# EAGLE design EH 400 Mini-Synth (EAGLE 9.6.2)
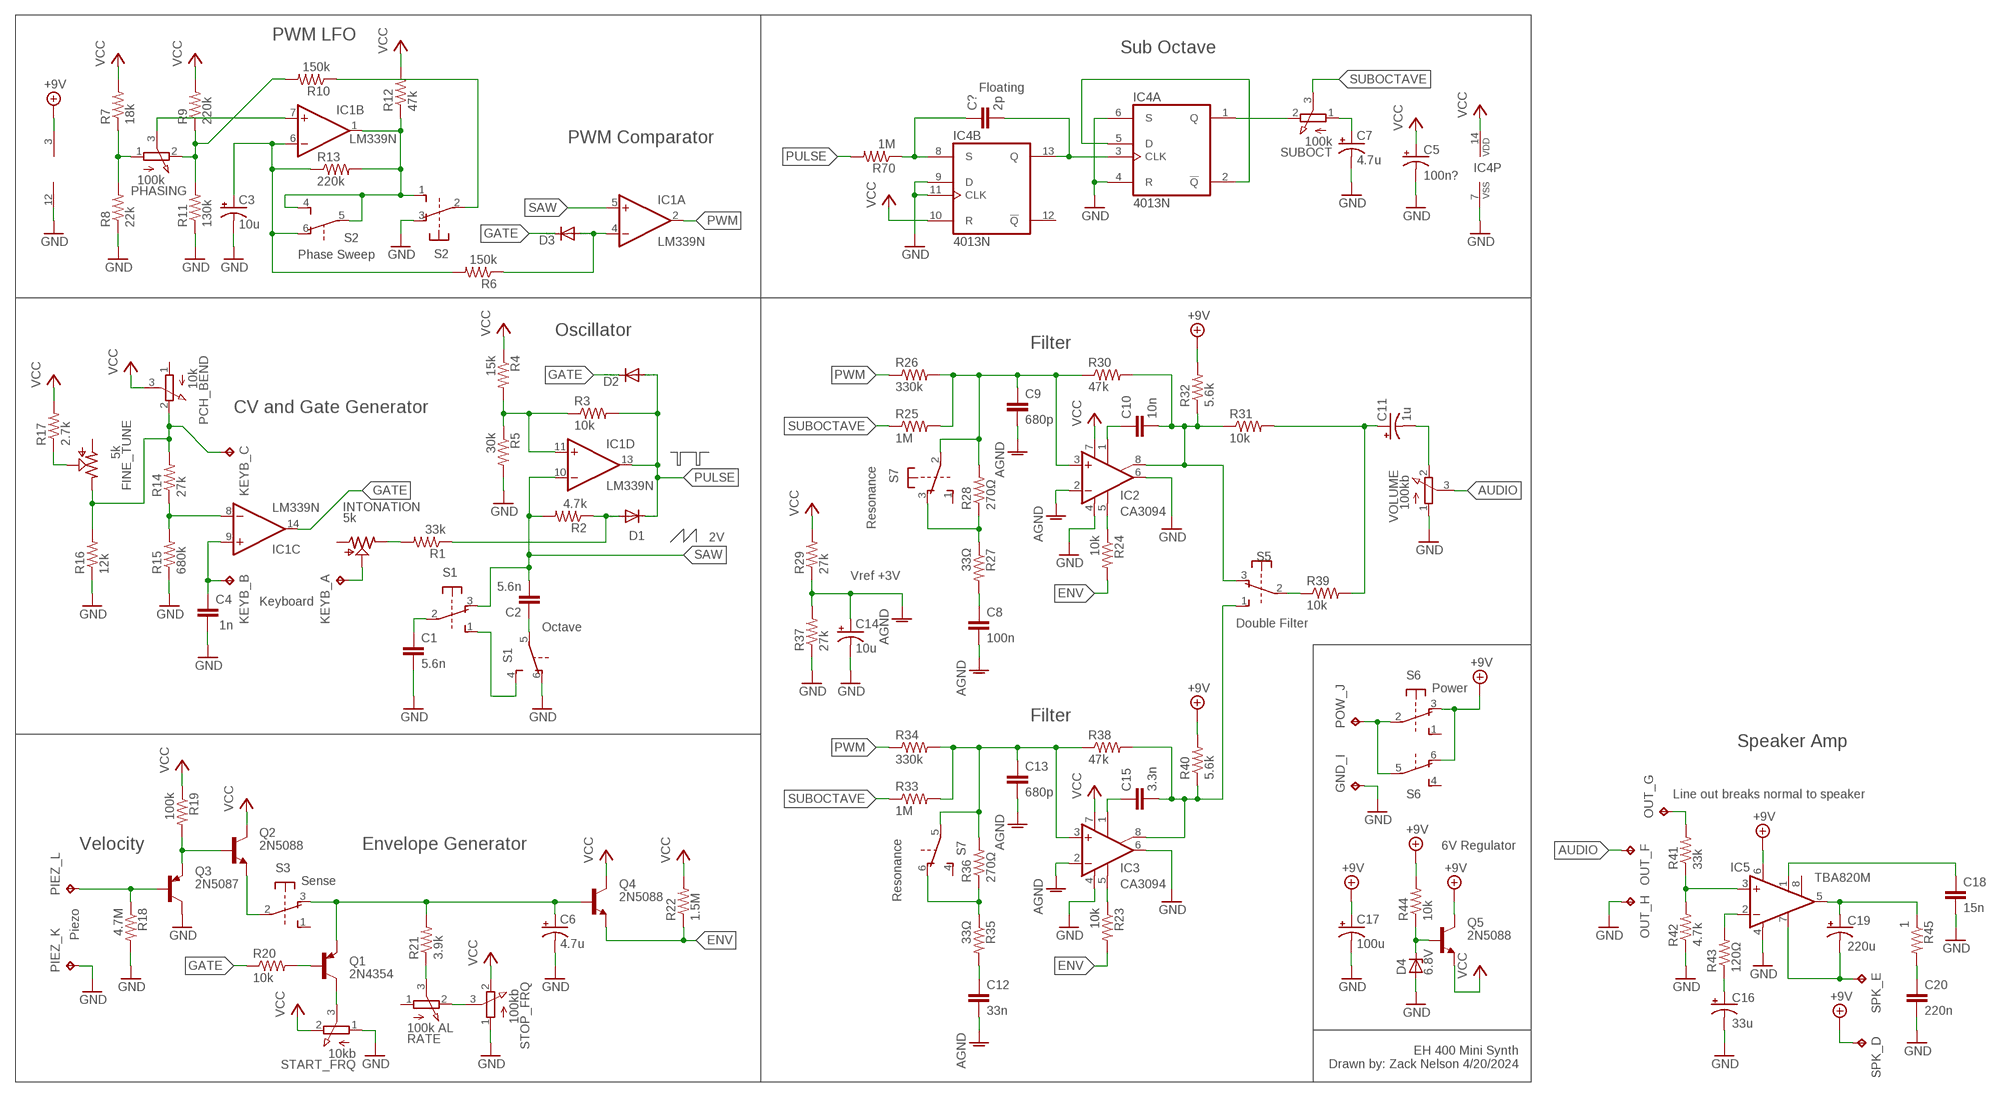
[diagram p0: schematic, sheet 1]

## Parts
C1  5.6n  C-EU050-024X044  [C050-024X044]
C2  5.6n  C-EU050-024X044  [C050-024X044]
C3  10u  CPOL-USE3.5-8  [E3,5-8]
C4  1n  C-EU050-024X044  [C050-024X044]
C5  100n?  CPOL-USE3.5-8  [E3,5-8]
C6  4.7u  CPOL-USE3.5-8  [E3,5-8]
C7  4.7u  CPOL-USE5-4  [E5-4]
C8  100n  C-EU050-024X044  [C050-024X044]
C9  680p  C-EU050-024X044  [C050-024X044]
C10  10n  C-EU050-025X075  [C050-025X075]
C11  1u  CPOL-USE5-4  [E5-4]
C12  33n  C-EU050-024X044  [C050-024X044]
C13  680p  C-EU050-024X044  [C050-024X044]
C14  10u  CPOL-USE3.5-8  [E3,5-8]
C15  3.3n  C-EU050-024X044  [C050-024X044]
C16  33u  CPOL-USE3.5-8  [E3,5-8]
C17  100u  CPOL-USTT5D9  [TT5D9]
C18  15n  C-EU050-024X044  [C050-024X044]
C19  220u  CPOL-USTT5D9  [TT5D9]
C20  220n  C-EU050-024X044  [C050-024X044]
C?  2p  C-EU075-032X103  [C075-032X103]
D1  DIODE-DO07  [DO07]
D2  DIODE-DO07  [DO07]
D3  DIODE-DO07  [DO07]
D4  6.8V  ZENER-DIODEZD-7.5  [ZDIO-7.5]
FINE_TUNE  5k  TRIM_US-ECP10S  [ECP10S]
GND_I  TPB1,27  [B1,27]
IC1  LM339N  [DIL14]
IC2  CA3094  LM3080N  [DIL08]
IC3  CA3094  LM3080N  [DIL08]
IC4  4013N  [DIL14]
IC5  TBA820M  LM386N-1  [DIL08]
INTONATION  5k  TRIM_US-ECP10S  [ECP10S]
KEYB_A  TPB1,27  [B1,27]
KEYB_B  TPB1,27  [B1,27]
KEYB_C  TPB1,27  [B1,27]
OUT_F  TPB1,27  [B1,27]
OUT_G  TPB1,27  [B1,27]
OUT_H  TPB1,27  [B1,27]
PCH_BEND  10k  EVUF  [FADER-EHX]
PHASING  100k  EVUF  [FADER-EHX]
PIEZ_K  TPB1,27  [B1,27]
PIEZ_L  TPB1,27  [B1,27]
POW_J  TPB1,27  [B1,27]
Q1  2N4354  2N5087-PNP-TO92-EBC  [TO92-EBC]
Q2  2N5088  2N5088-NPN-TO92-EBC  [TO92-EBC]
Q3  2N5087  2N5087-PNP-TO92-EBC  [TO92-EBC]
Q4  2N5088  2N5088-NPN-TO92-EBC  [TO92-EBC]
Q5  2N5088  2N5088-NPN-TO92-EBC  [TO92-EBC]
R1  33k  R-US_0207/12  [0207/12]
R2  4.7k  R-US_0207/12  [0207/12]
R3  10k  R-US_0207/12  [0207/12]
R4  15k  R-US_0207/12  [0207/12]
R5  30k  R-US_0207/12  [0207/12]
R6  150k  R-US_0207/12  [0207/12]
R7  18k  R-US_0207/12  [0207/12]
R8  22k  R-US_0207/12  [0207/12]
R9  220k  R-US_0207/12  [0207/12]
R10  150k  R-US_0207/12  [0207/12]
R11  130k  R-US_0207/12  [0207/12]
R12  47k  R-US_0207/12  [0207/12]
R13  220k  R-US_0207/12  [0207/12]
R14  27k  R-US_0207/12  [0207/12]
R15  680k  R-US_0207/12  [0207/12]
R16  12k  R-US_0207/12  [0207/12]
R17  2.7k  R-US_0207/12  [0207/12]
R18  4.7M  R-US_0207/12  [0207/12]
R19  100k  R-US_0207/12  [0207/12]
R20  10k  R-US_0207/12  [0207/12]
R21  3.9k  R-US_0207/12  [0207/12]
R22  1.5M  R-US_0207/12  [0207/12]
R23  10k  R-US_0207/12  [0207/12]
R24  10k  R-US_0207/12  [0207/12]
R25  1M  R-US_0207/12  [0207/12]
R26  330k  R-US_0207/12  [0207/12]
R27  33Ω  R-US_0207/12  [0207/12]
R28  270Ω  R-US_0207/12  [0207/12]
R29  27k  R-US_0207/12  [0207/12]
R30  47k  R-US_0207/12  [0207/12]
R31  10k  R-US_0207/12  [0207/12]
R32  5.6k  R-US_0207/12  [0207/12]
R33  1M  R-US_0207/12  [0207/12]
R34  330k  R-US_0207/12  [0207/12]
R35  33Ω  R-US_0207/12  [0207/12]
R36  270Ω  R-US_0207/12  [0207/12]
R37  27k  R-US_0207/12  [0207/12]
R38  47k  R-US_0207/12  [0207/12]
R39  10k  R-US_0207/12  [0207/12]
R40  5.6k  R-US_0207/12  [0207/12]
R41  33k  R-US_0207/12  [0207/12]
R42  4.7k  R-US_0207/12  [0207/12]
R43  120Ω  R-US_0207/12  [0207/12]
R44  10k  R-US_0207/12  [0207/12]
R45  1  R-US_0207/12  [0207/12]
R70  1M  R-US_0207/12  [0207/12]
RATE  100k AL  EVUF  [FADER-EHX]
S1  Octave  9077-2S  [SLIDE]
S2  Phase  9077-2S  [SLIDE]
S3  Sense  9077-2S  [SLIDE]
S5  Double Filter  9077-2S  [SLIDE]
S6  Power  9077-2S  [SLIDE]
S7  9077-2S  [SLIDE]
SPK_D  TPB1,27  [B1,27]
SPK_E  TPB1,27  [B1,27]
START_FRQ  10kb  EVUF  [FADER-EHX]
STOP_FRQ  100kb  EVUF  [FADER-EHX]
SUBOCT  100k  EVUF  [FADER-EHX]
VOLUME  100kb  EVUF  [FADER-EHX]

## Nets
+9V: C17.+ IC1.3(P:V+) IC5.6(VS) Q5.C R32.2 R40.2 R44.2 S6.3(1:O) S6.6(2:O) SPK_D.TP
AGND: C8.2 C9.2 C12.2 C13.2 C14.+ IC2.2(-IN) IC3.2(-IN) R29.1 R37.2
AUDIO: OUT_F.TP VOLUME.3(S)
C: FINE_TUNE.E KEYB_C.TP PCH_BEND.2(E) R14.2 R16.2
ENV: Q4.E R22.1 R23.2 R24.2
GATE: D2.C D3.C IC1.14(C:OUT) R20.1
GND: C1.2 C3.- C4.2 C5.- C6.- C7.- C14.- C16.- C17.- C18.2 C20.2 D4.A GND_I.TP IC1.12(P:GND) IC2.4(V-) IC2.6(OUT) IC3.4(V-) IC3.6(OUT) IC4.4(A:R) IC4.6(A:S) IC4.7(P:VSS) IC4.9(B:D) IC4.11(B:CLK) IC5.4(GND) OUT_H.TP PIEZ_K.TP Q3.C R5.2 R8.1 R11.1 R15.1 R16.1 R18.2 R37.1 R42.1 S1.6(2:O) S2.3(1:O) START_FRQ.1(A) STOP_FRQ.1(A) VOLUME.1(A)
LFO_TRI: C3.+ IC1.6(B:-IN) R6.2 R13.1 S2.6(2:O)
N$1: C?.1 IC4.8(B:S) R70.1
N$2: D1.A R1.1 R2.1
N$3: INTONATION.E R1.2
N$4: IC1.11(D:+IN) R3.1 R4.2 R5.1
N$5: C?.2 IC4.3(A:CLK) IC4.13(B:Q)
N$6: IC1.1(B:OUT) R12.1 R13.2 S2.1(1:S) S2.4(2:S) S2.5(2:P)
N$7: D3.A IC1.4(A:-IN) R6.1
N$8: IC4.2(A:!Q) IC4.5(A:D)
N$9: PIEZ_L.TP Q3.B R18.1
N$10: S1.1(1:S) S1.4(2:S)
N$11: C1.1 S1.2(1:P)
N$12: C2.1 S1.5(2:P)
N$13: PHASING.1(A) R7.1 R8.2
N$14: PHASING.2(E) R9.1 R10.2 R11.2
N$15: IC1.7(B:+IN) PHASING.3(S)
N$16: R10.1 S2.2(1:P)
N$17: Q2.B Q3.E R19.2
N$18: C4.1 IC1.9(C:+IN) KEYB_B.TP
N$19: INTONATION.S KEYB_A.TP
N$20: IC1.8(C:-IN) R14.1 R15.2
N$21: Q2.E S3.2(1:P)
N$22: FINE_TUNE.S R17.1
N$23: RATE.2(E) STOP_FRQ.3(S)
N$24: C19.+ IC5.5(OUT) R45.1
N$25: C6.+ Q1.E Q4.B R21.2 S3.3(1:O)
N$26: Q1.B R20.2
N$27: R21.1 RATE.3(S)
N$28: Q1.C START_FRQ.3(S)
N$29: C18.1 IC5.1(GAIN)
N$30: C7.+ SUBOCT.1(A)
N$31: R39.1 S5.2(1:P)
N$32: IC2.5(OPT) R24.1
N$33: C9.1 IC2.3(+IN) R25.2 R26.2 R28.2 R30.1 S7.2(1:P)
N$34: IC4.1(A:Q) SUBOCT.2(E)
N$35: C8.1 R27.2
N$36: C10.2 IC2.8(ON2) R30.2 R31.1 R32.1 S5.3(1:O)
N$37: R27.1 R28.1 S7.3(1:O)
N$38: IC3.5(OPT) R23.1
N$39: C10.1 IC2.1(ON1)
N$40: C12.1 R35.2
N$41: R35.1 R36.1 S7.6(2:O)
N$42: C15.1 IC3.1(ON1)
N$43: C15.2 IC3.8(ON2) R38.2 R40.1 S5.1(1:S)
N$44: C13.1 IC3.3(+IN) R33.2 R34.2 R36.2 R38.1 S7.5(2:P)
N$45: C11.+ R31.2 R39.2
N$46: C11.- VOLUME.2(E)
N$47: C20.1 R45.2
N$48: C19.- IC5.7(BYPASS) SPK_E.TP
N$49: D4.C Q5.B R44.1
N$50: IC5.2(-IN) R43.2
N$51: C16.+ R43.1
N$52: OUT_G.TP R41.2
N$53: IC5.3(+IN) R41.1 R42.2
N$54: POW_J.TP S6.2(1:P) S6.5(2:P)
PULSE: D1.C D2.A IC1.13(D:OUT) R3.2 R70.2
PWM: IC1.2(A:OUT) R26.1 R34.1
SAW: C2.2 IC1.5(A:+IN) IC1.10(D:-IN) R2.2 S1.3(1:O)
SUBOCTAVE: R25.1 R33.1 SUBOCT.3(S)
VCC: C5.+ IC2.7(V+) IC3.7(V+) IC4.10(B:R) IC4.14(P:VDD) PCH_BEND.3(S) Q2.C Q4.C Q5.E R4.1 R7.2 R9.2 R12.2 R17.2 R19.1 R22.2 R29.2 START_FRQ.2(E) STOP_FRQ.2(E)
Unconnected: FINE_TUNE.A IC4.12(B:!Q) IC5.8(GAIN) INTONATION.A PCH_BEND.1(A) RATE.1(A) S3.1(1:S) S3.4(2:S) S3.5(2:P) S3.6(2:O) S5.4(2:S) S5.5(2:P) S5.6(2:O) S6.1(1:S) S6.4(2:S) S7.1(1:S) S7.4(2:S)

## Notes on the sheet
- PWM LFO
- Sub Octave
- Floating
- PWM Comparator
- Phase Sweep
- Oscillator
- Filter
- CV and Gate Generator
- Resonance
- 2V
- Vref +3V
- Keyboard
- Octave
- Filter
- Speaker Amp
- Line out breaks normal to speaker
- Velocity | Envelope Generator | 6V Regulator
- Resonance
- Piezo
- EH 400 Mini Synth
  Drawn by: Zack Nelson 4/20/2024

## Library data of the parts
C1 C2 C4 C8-C10 C12 C13 C15 C18 C20 C? = rcl:C-EU: CAPACITOR, European symbol; SPICEPREFIX: C
C3 C5-C7 C11 C14 C16 C17 C19 = rcl:CPOL-US: POLARIZED CAPACITOR, American symbol; SPICEPREFIX: C
D1-D3 = diode:DIODE-: DIODE
D4 = diode:ZENER-DIODE: Z-Diode
FINE_TUNE INTONATION = pot2:TRIM_US-: POTENTIOMETER
GND_I KEYB_A KEYB_B KEYB_C OUT_F OUT_G OUT_H PIEZ_K PIEZ_L POW_J SPK_D SPK_E = testpad:TP: Test pad
IC1 = linear:LM339: Low Power Low Offset Voltage Quad Comparators with open collector; LM139/LM239/LM339/LM2901/LM3302
IC2 IC3 = linear@1:*3080: OP AMP
IC4 = 40xx:4013: Dual D FLIP FLOP, set/reset
IC5 = linear:LM386?-*: Low Voltage Audio Power Amplifier Source: http://cache.national.com/ds/LM/LM386.pdf
PCH_BEND PHASING RATE START_FRQ STOP_FRQ SUBOCT VOLUME = pot:EVU: 9 mm Square Rotary Potentiometers Source: Panasonic
Q1 Q3 = transistor-neu-to92:*-PNP-: PNP Transistror
Q2 Q4 Q5 = transistor-neu-to92:*-NPN-: NPN Transistror
R1-R45 R70 = rcl:R-US_: RESISTOR, American symbol; SPICEPREFIX: R
S1-S3 S5-S7 = switch-misc:9077-2: MARQUARDT SWITCH 9077.0200 Distributor: Buerklin <https://www.buerklin.com/default.asp?event=ShowArtikel%2812G2822%29&l=d&jump=ArtNr_12G2822>

## Board
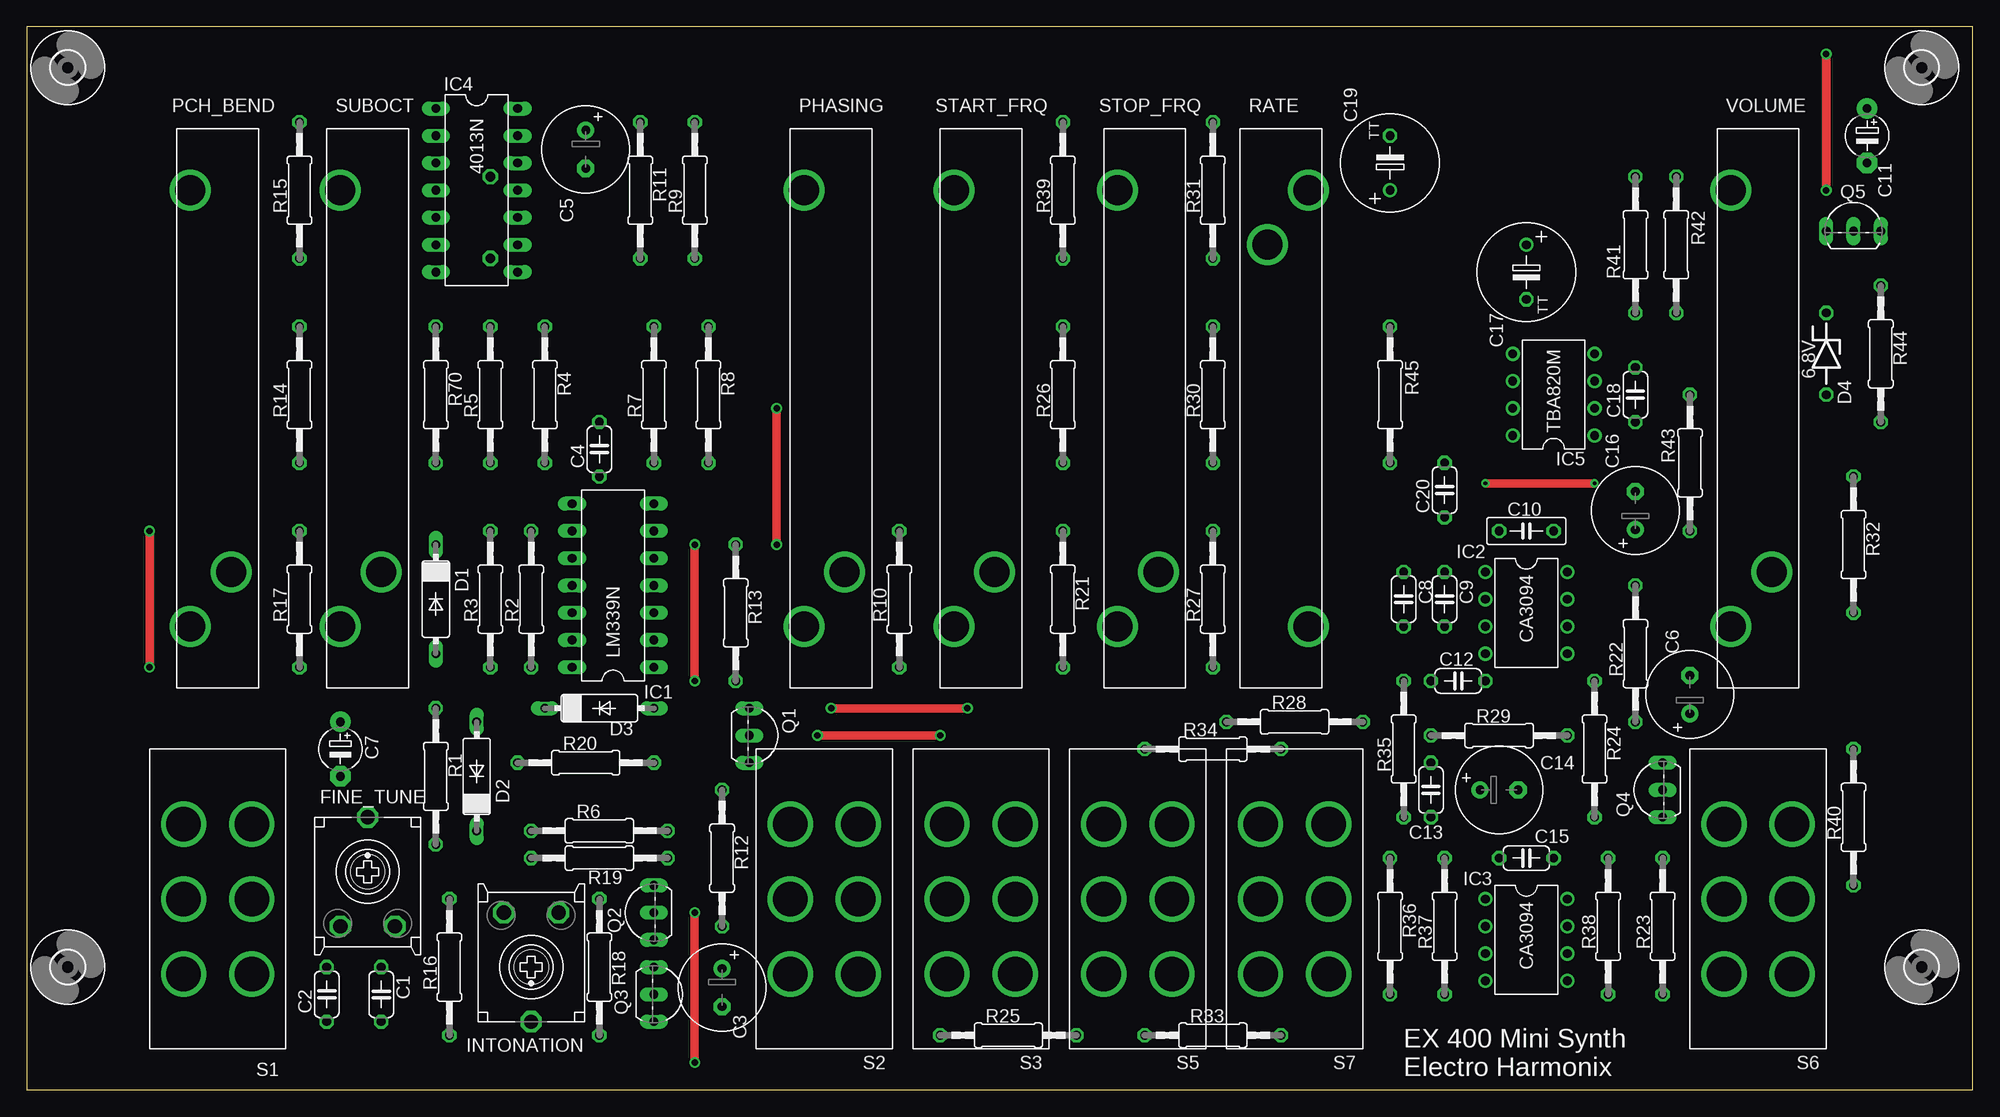
[diagram p1: board, top side]
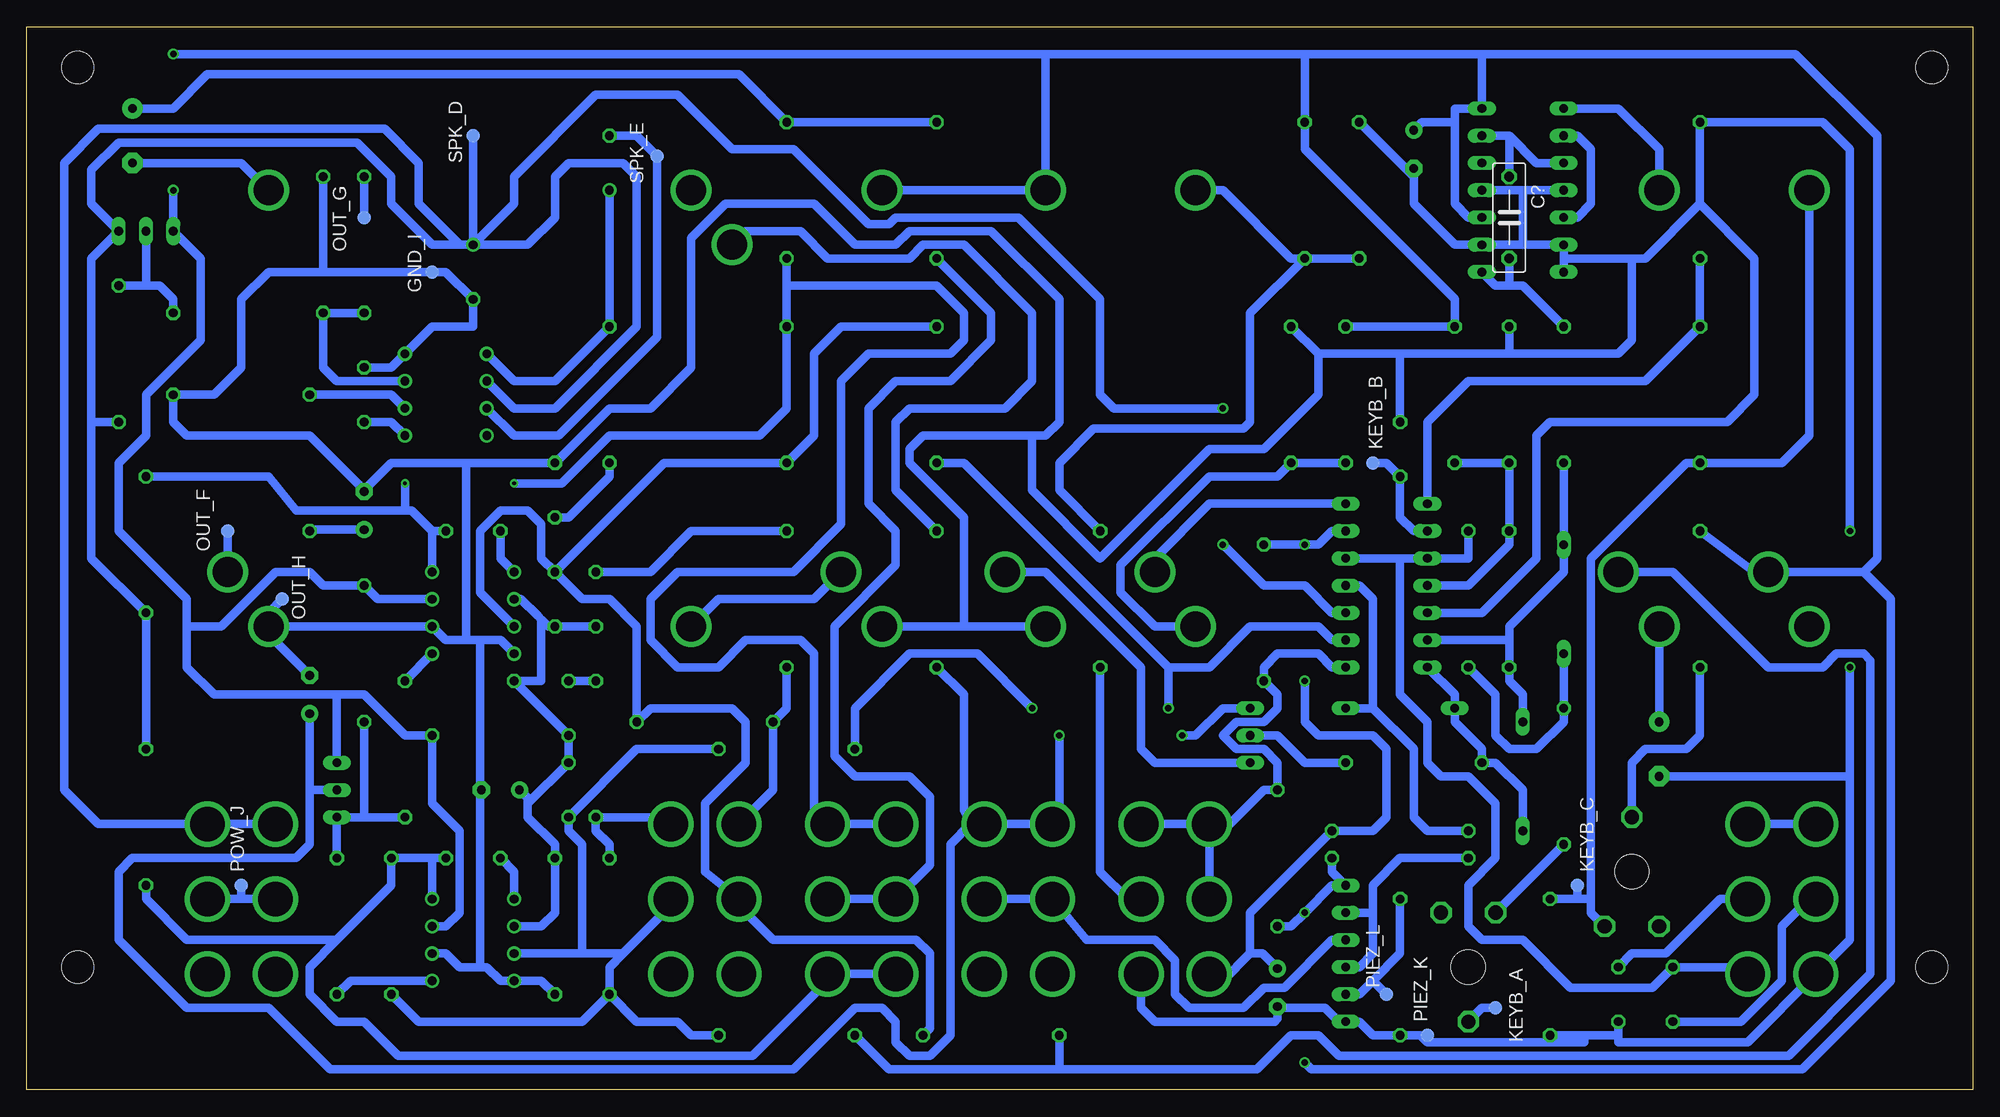
[diagram p2: board, bottom side, seen from below]

Size 181.28 x 99.05 mm. Coordinates in mm from the lower left corner, seen from the top.
Outline: 0,0 181.28,0 181.28,99.05 0,99.05 0,0
Copper layers (1*16): Top 0.035mm / dielectric 1.5mm / Bottom 0.035mm
Design rules "default": minimum track width 6mil, minimum drill 0.35mm, track to track 6mil, track to pad 6mil, pad to pad 6mil, via to via 6mil, smd to smd 6mil, copper to edge 40mil, drill to drill 6mil, minimum pad ring 10mil, minimum via ring 8mil, stop-mask expansion 4mil, vias tented up to drill 0mil, thermal gap 10mil
Holes 3.2 mm at 31.75,20.32 46.99,11.43

### Footprints (pad centres in the part's own frame; a part is rotated, then mirrored left to right if it is on the bottom)
C050-024X044 = drill 0.813 octagon: 1 -2.54,0; 2 2.54,0
E3,5-8 = drill 0.813 pad 1.6: + -1.778,0 | drill 0.813 pad 1.6 octagon: - 1.778,0
E5-4 = drill 0.813 pad 1.905: + -2.54,0 | drill 0.813 pad 1.905 octagon: - 2.54,0
C050-025X075 = drill 0.813 octagon: 1 -2.54,0; 2 2.54,0
TT5D9 = drill 0.813: + -2.54,0 | drill 0.813 octagon: - 2.54,0
C075-032X103 = drill 0.914 octagon: 1 -3.81,0; 2 3.81,0
DO07 = drill 0.813 long: A 5.08,0; C -5.08,0
ZDIO-7.5 = drill 0.813 octagon: A 3.81,0; C -3.81,0
ECP10S = drill 1.321 octagon: A -2.54,-5.08; E 2.54,-5.08; S 0,5.08
B1,27 = smd 1.27 x 1.27: TP 0,0
DIL14 = drill 0.813 long: 1 -7.62,-3.81; 2 -5.08,-3.81; 3 -2.54,-3.81; 4 0,-3.81; 5 2.54,-3.81; 6 5.08,-3.81; 7 7.62,-3.81; 8 7.62,3.81; 9 5.08,3.81; 10 2.54,3.81; 11 0,3.81; 12 -2.54,3.81; 13 -5.08,3.81; 14 -7.62,3.81
DIL08 = drill 0.813 pad 1.27: 1 -3.81,-3.81; 2 -1.27,-3.81; 3 1.27,-3.81; 4 3.81,-3.81; 5 3.81,3.81; 6 1.27,3.81; 7 -1.27,3.81; 8 -3.81,3.81
FADER-EHX = drill 2.8: 1 -2.54,-20.32; 2 -2.54,20.32; 3 1.27,-15.24
TO92-EBC = drill 0.813 long: B 0,-1.27; C 2.54,-1.27; E -2.54,-1.27
0207/12 = drill 0.813 octagon: 1 -6.35,0; 2 6.35,0
SLIDE = drill 3.2: 1 -6.985,3.175; 2 0,3.175; 3 6.985,3.175; 4 -6.985,-3.175; 5 0,-3.175; 6 6.985,-3.175
3,0 = hole 3: 0,0

### Placement (x,y rotation side)
C1  33.02,8.89 270 top
C2  27.94,8.89 90 top
C3  64.77,9.53 270 top
C4  53.34,59.69 90 top
C5  52.07,87.63 270 top
C6  154.94,36.83 90 top
C7  29.21,31.75 270 top
C8  128.27,45.72 270 top
C9  132.08,45.72 270 top
C10  139.7,52.07 0 top
C11  171.45,88.9 270 top
C12  133.35,38.1 0 top
C13  130.81,27.94 90 top
C14  137.16,27.94 0 top
C15  139.7,21.59 0 top
C16  149.86,53.98 90 top
C17  139.7,76.2 270 top
C18  149.86,64.77 90 top
C19  127,86.36 90 top
C20  132.08,55.88 90 top
C?  43.18,81.28 90 bottom
D1  38.1,45.72 270 top
D2  41.91,29.21 90 top
D3  53.34,35.56 0 top
D4  167.64,68.58 270 top
FINE_TUNE  31.75,20.32 0 top
GND_I  143.51,76.2 90 bottom
IC1  54.61,46.99 90 top
IC2  139.7,44.45 270 top
IC3  139.7,13.97 270 top
IC4  41.91,83.82 270 top
IC5  142.24,64.77 90 top
INTONATION  46.99,11.43 180 top
KEYB_A  44.45,7.62 0 bottom
KEYB_B  55.88,58.42 0 bottom
KEYB_C  36.83,19.05 0 bottom
OUT_F  162.56,52.07 90 bottom
OUT_G  149.86,81.28 270 bottom
OUT_H  157.48,45.72 90 bottom
PCH_BEND  17.78,63.5 0 top
PHASING  74.93,63.5 0 top
PIEZ_K  50.8,5.08 0 bottom
PIEZ_L  54.61,8.89 0 bottom
POW_J  161.29,19.05 0 bottom
Q1  68.58,33.02 270 top
Q2  57.15,16.51 90 top
Q3  59.69,8.89 270 top
Q4  151.13,27.94 90 top
Q5  170.18,81.28 0 top
R1  38.1,29.21 270 top
R2  46.99,45.72 90 top
R3  43.18,45.72 270 top
R4  48.26,64.77 270 top
R5  43.18,64.77 90 top
R6  53.34,24.13 0 top
R7  58.42,64.77 90 top
R8  63.5,64.77 270 top
R9  62.23,83.82 90 top
R10  81.28,45.72 90 top
R11  57.15,83.82 270 top
R12  64.77,21.59 270 top
R13  66.04,44.45 270 top
R14  25.4,64.77 270 top
R15  25.4,83.82 270 top
R16  39.37,11.43 90 top
R17  25.4,45.72 90 top
R18  53.34,11.43 270 top
R19  53.34,21.59 180 top
R20  52.07,30.48 0 top
R21  96.52,45.72 270 top
R22  149.86,40.64 90 top
R23  152.4,15.24 90 top
R24  146.05,31.75 270 top
R25  91.44,5.08 0 top
R26  96.52,64.77 90 top
R27  110.49,45.72 90 top
R28  118.11,34.29 0 top
R29  137.16,33.02 0 top
R30  110.49,64.77 90 top
R31  110.49,83.82 90 top
R32  170.18,50.8 270 top
R33  110.49,5.08 0 top
R34  110.49,31.75 0 top
R35  128.27,31.75 90 top
R36  127,15.24 270 top
R37  132.08,15.24 90 top
R38  147.32,15.24 90 top
R39  96.52,83.82 90 top
R40  170.18,25.4 90 top
R41  149.86,78.74 90 top
R42  153.67,78.74 270 top
R43  154.94,58.42 90 top
R44  172.72,68.58 270 top
R45  127,64.77 270 top
R70  38.1,64.77 270 top
RATE  116.84,63.5 180 top
S1  17.78,17.78 270 top
S2  74.3,17.78 270 top
S3  88.9,17.78 90 top
S5  103.5,17.78 90 top
S6  161.29,17.78 90 top
S7  118.11,17.78 90 top
SPK_D  139.7,88.9 90 bottom
SPK_E  122.56,87 270 bottom
START_FRQ  88.9,63.5 0 top
STOP_FRQ  104.14,63.5 0 top
SUBOCT  31.75,63.5 0 top
U$1  [3,0]  3.81,95.25 0 top
U$2  [3,0]  176.53,95.25 0 top
U$3  [3,0]  3.81,11.43 0 top
U$4  [3,0]  176.53,11.43 0 top
VOLUME  161.29,63.5 0 top

### Tracks (layer width: path | path; a pad name or v marks a point on that pad's centre or on a via)
+9V  (via drill 0.6)
  Top 0.813: v69.85,50.8 v69.85,63.5
  Bottom 0.813: IC1.3 59.69,44.45 62.23,46.99 66.04,46.99 v69.85,50.8 | v69.85,63.5 80.01,63.5 81.28,64.77 81.28,73.66 88.9,81.28 100.33,81.28 100.97,80.64 102.87,80.64 109.86,87.63 115.57,87.63 120.65,92.71 128.27,92.71 135.89,85.09 135.89,82.55 C17.+ | 175.26,62.23 175.26,77.47 Q5.C 175.26,82.55 175.26,85.72 172.72,88.27 150.5,88.27 147.32,85.09 147.32,82.55 143.51,78.74 140.97,78.74 | 175.26,62.23 175.26,49.53 R32.2 R40.2 | S6.3 S6.6 174.62,24.77 177.8,27.94 177.8,86.36 174.62,89.53 147.96,89.53 144.78,86.36 144.78,82.55 140.97,78.74 | C17.+ 134.62,78.74 132.08,81.28 132.08,85.09 130.81,86.36 125.73,86.36 124.46,85.09 124.46,71.12 132.08,63.5 135.89,63.5 IC5.6 | 140.97,78.74 C17.+ | C17.+ SPK_D.TP | R44.2 175.26,62.23
AGND
  Bottom 0.813: IC3.2 133.35,15.24 132.08,16.51 R37.2 132.08,22.86 134.62,25.4 134.62,26.67 | 134.62,26.67 C13.2 R29.1 C12.2 133.35,38.1 133.35,43.81 | 134.62,26.67 134.62,27.18 C14.+ | C8.2 C9.2 132.72,43.18 133.35,43.81 | IC2.2 135.25,45.72 133.67,44.13 133.35,43.81
AUDIO
  Bottom 0.813: OUT_F.TP VOLUME.3
C
  Bottom 0.813: 35.56,17.78 35.56,16.51 FINE_TUNE.E | R16.2 36.83,17.78 | 36.83,17.78 35.56,17.78 | 35.56,17.78 35.56,49.53 26.67,58.42 R14.2 17.78,58.42 15.24,60.96 PCH_BEND.2 | KEYB_C.TP 36.83,17.78
ENV
  Bottom 0.813: 149.86,25.4 Q4.E R23.2 | 149.86,25.4 R24.2 | R22.1 149.86,25.4
GATE
  Bottom 0.813: IC1.14 48.26,36.83 D3.C 48.26,34.29 45.72,31.75 R20.1 44.45,30.48 41.91,27.94 D2.C
GND  (via drill 0.6)
  Top 0.813: v11.43,52.07 v11.43,39.37
  Bottom 0.813: IC4.4 41.91,83.82 | 41.91,83.82 IC4.11 | 41.91,83.82 41.91,78.74 | 41.91,78.74 IC4.6 38.1,77.47 | IC4.7 38.1,77.47 | R5.2 43.18,68.58 | 43.18,68.58 53.34,68.58 | 53.34,68.58 60.96,68.58 | 43.18,68.58 33.02,68.58 31.75,69.85 31.75,77.47 | 31.75,77.47 38.1,77.47 | R37.1 133.35,10.16 IC3.4 137.16,10.16 138.43,11.43 139.06,11.43 | 140.34,41.91 142.24,41.91 IC2.6 VOLUME.1 | 41.91,78.74 IC4.9 48.26,78.74 52.07,82.55 52.07,85.09 52.7,85.72 | C4.2 53.34,68.58 | 33.02,5.08 33.02,4.45 20.95,4.45 S1.6 11.43,13.97 11.43,29.21 | 33.02,5.08 C1.2 | R18.2 51.44,5.08 50.8,4.45 36.2,4.45 36.2,5.08 R16.1 33.02,5.08 | R11.1 52.7,85.72 | IC3.6 142.24,12.7 140.97,11.43 139.06,11.43 | IC2.4 137.16,41.91 139.06,41.91 | 139.06,41.91 140.34,41.91 | R18.2 55.88,5.08 57.15,6.35 Q3.C 59.05,6.35 60.33,7.62 64.77,7.62 C3.- 64.77,6.6 65.02,6.35 76.2,6.35 77.47,7.62 S2.3 | IC1.12 45.72,44.45 40.64,49.53 40.64,60.96 39.37,62.23 22.86,62.23 20.32,64.77 20.32,77.47 25.4,82.55 | 25.4,82.55 30.48,77.47 31.75,77.47 | v11.43,52.07 11.43,87.63 13.97,90.17 R15.1 25.4,82.55 | v11.43,39.37 11.43,29.21 | 11.43,29.21 C7.- | 139.06,41.91 139.06,27.94 | 139.06,27.94 139.06,11.43 | C14.- 139.06,27.94 | START_FRQ.1 93.98,43.18 | STOP_FRQ.1 93.98,43.18 | 93.98,43.18 93.98,53.34 99.06,58.42 99.06,59.69 97.79,60.96 87.63,60.96 | 87.63,60.96 86.36,60.96 85.09,62.23 85.09,73.66 91.44,80.01 99.06,80.01 100.33,78.74 104.14,78.74 107.95,82.55 116.2,82.55 119.38,79.38 119.38,67.31 123.19,63.5 127,63.5 C20.2 140.34,58.42 | R8.1 60.96,68.58 | 60.96,68.58 60.96,64.77 66.04,59.69 71.12,59.69 81.28,49.53 87.63,55.88 87.63,60.96 | C18.2 147.32,67.31 IC5.4 143.51,71.12 139.7,71.12 C17.- 142.24,76.2 GND_I.TP 153.67,76.2
  Bottom 0.813: R42.1 153.67,76.2 | 153.67,76.2 158.75,76.2 161.29,73.66 161.29,67.31 163.83,64.77 D4.A 167.64,62.23 166.37,60.96 154.94,60.96 149.86,55.88 | C6.- 158.75,42.42 VOLUME.1 | OUT_H.TP 158.75,44.45 VOLUME.1 | C5.- 52.58,85.85 52.7,85.72 | C16.- 149.86,55.88 | 149.86,55.88 147.32,58.42 140.34,58.42 | 140.34,58.42 140.34,41.91 | R18.2 PIEZ_K.TP
LFO_TRI  (via drill 0.6)
  Top 0.813: v62.23,38.1 v62.23,50.8
  Bottom 0.813: IC1.6 59.69,52.07 60.96,50.8 v62.23,50.8 R13.1 | v62.23,38.1 62.23,34.29 60.96,33.02 55.88,33.02 54.61,31.75 54.61,25.4 55.88,24.13 R6.2 67.31,16.51 67.31,12.7 | 67.31,12.7 69.85,10.16 71.12,10.16 S2.6 | C3.+ 66.17,12.7 67.31,12.7
N$1
  Bottom 0.813: R70.1 41.91,74.93 43.18,74.93 | IC4.8 44.45,74.93 43.18,74.93 | C?.1 43.18,74.93
N$2
  Bottom 0.813: D1.A R1.1 38.1,34.29 40.64,31.75 43.18,31.75 44.45,33.02 44.45,36.83 R2.1
N$3
  Bottom 0.813: R1.2 INTONATION.E
N$4
  Bottom 0.813: IC1.11 46.99,46.99 43.18,50.8 R3.1 R5.1 R4.2
N$5
  Bottom 0.813: 43.18,88.9 40.64,86.36 IC4.3 | 43.18,88.9 IC4.13 | C?.2 43.18,88.9
N$6
  Bottom 0.813: IC1.1 59.69,39.37 60.96,40.64 64.77,40.64 66.04,39.37 R13.2 64.77,36.83 64.77,35.56 66.04,34.29 68.58,34.29 69.85,33.02 68.58,31.75 66.04,31.75 64.77,30.48 R12.1 66.04,27.94 69.85,24.13 71.12,24.13 | S2.1 S2.4 71.12,24.13 | 71.12,24.13 S2.5
N$7
  Bottom 0.813: IC1.4 57.15,46.99 55.88,45.72 55.88,35.56 | R6.1 50.8,24.13 52.07,25.4 52.07,31.75 55.88,35.56 | 55.88,35.56 D3.A
N$8
  Bottom 0.813: IC4.2 36.83,88.9 35.56,87.63 35.56,82.55 36.83,81.28 IC4.5
N$9
  Bottom 0.813: R18.1 53.34,12.7 55.88,10.16 | 55.88,10.16 57.15,8.89 Q3.B | PIEZ_L.TP 55.88,10.16
N$10
  Bottom 0.813: S1.4 S1.1
N$11
  Bottom 0.813: C1.1 31.75,12.7 28.57,12.7 23.5,17.78 S1.2
N$12
  Bottom 0.813: C2.1 21.59,6.35 17.78,10.16 17.78,15.24 15.24,17.78 S1.5
N$13
  Bottom 0.813: R7.1 R8.2 64.77,57.15 71.12,57.15 79.38,48.9 79.38,46.35 76.2,43.18 PHASING.1
N$14
  Bottom 0.813: R11.2 R9.1 | R9.1 63.5,77.47 69.85,83.82 PHASING.2 | R10.2 85.09,55.88 85.09,58.42 81.92,61.59 67.94,61.59 67.31,62.23 67.31,72.39 R9.1
N$15
  Bottom 0.813: IC1.7 71.12,54.61 76.2,49.53 PHASING.3
N$16
  Bottom 0.813: R10.1 81.28,20.32 78.74,17.78 S2.2
N$17
  Bottom 0.813: 55.88,16.51 55.88,12.7 57.15,11.43 Q3.E | 55.88,16.51 Q2.B | R19.2 53.34,21.59 55.88,19.05 55.88,16.51
N$18
  Bottom 0.813: IC1.9 52.07,52.07 53.34,53.34 C4.1 54.61,58.42 KEYB_B.TP
N$19
  Bottom 0.813: INTONATION.S 45.72,7.62 KEYB_A.TP
N$20
  Bottom 0.813: R15.2 R14.1 30.48,66.04 46.99,66.04 50.8,62.23 IC1.8
N$21
  Bottom 0.813: Q2.E 59.69,13.97 64.14,9.53 66.04,9.53 67.94,7.62 73.03,7.62 74.3,8.89 74.3,12.06 76.2,13.97 82.55,13.97 S3.2 92.71,17.78
N$22
  Bottom 0.813: FINE_TUNE.S 31.75,30.48 30.48,31.75 26.67,31.75 25.4,33.02 R17.1
N$23
  Bottom 0.813: STOP_FRQ.3 107.95,45.72 116.84,45.72 RATE.2
N$24
  Bottom 0.813: IC5.5 135.89,66.04 132.08,66.04 R45.1 C19.+
N$25  (via drill 0.6)
  Top 0.813: v73.66,33.02 v85.09,33.02
  Bottom 0.813: Q1.E 69.85,35.56 72.39,33.02 v73.66,33.02 | v85.09,33.02 85.09,25.4 S3.3 93.34,24.77 | C6.+ 154.94,27.94 | 93.34,24.77 95.25,22.86 95.25,5.08 97.16,3.17 99.06,3.17 100.33,4.45 100.33,6.35 101.6,7.62 104.14,7.62 109.86,1.91 153.03,1.91 158.75,7.62 166.37,7.62 172.72,13.97 172.72,20.32 171.45,21.59 156.21,21.59 154.94,22.86 154.94,27.94 | 93.34,24.77 93.98,26.04 93.98,36.83 R21.2 | Q4.B 154.94,27.94
N$26
  Bottom 0.813: R20.2 59.69,30.48 62.23,30.48 64.77,33.02 Q1.B
N$27
  Bottom 0.813: R21.1 100.33,55.88 100.33,62.23 99.06,63.5 90.17,63.5 87.63,66.04 87.63,72.39 93.98,78.74 97.79,78.74 99.06,77.47 106.68,77.47 109.22,80.01 114.3,80.01 RATE.3
N$28
  Bottom 0.813: Q1.C 76.2,30.48 77.47,31.75 77.47,39.37 86.36,48.26 START_FRQ.3
N$29
  Bottom 0.813: IC5.1 147.32,62.23 C18.1
N$30
  Bottom 0.813: C7.+ SUBOCT.1
N$31
  Bottom 0.813: R39.1 91.44,72.39 91.44,69.85 95.25,66.04 100.33,66.04 102.87,63.5 102.87,54.61 100.33,52.07 100.33,48.9 106.05,43.18 106.05,31.11 104.14,29.21 99.06,29.21 97.16,27.3 97.16,20.95 S5.2 106.68,17.78
N$32
  Bottom 0.813: R24.1 IC2.5
N$33
  Bottom 0.813: IC2.3 139.06,46.35 139.06,52.07 137.16,53.98 134.62,53.98 133.35,52.7 133.35,49.53 C9.1 | R26.2 105.41,71.12 107.95,68.58 107.95,60.96 R30.1 121.92,58.42 C9.1 | C9.1 129.54,45.72 127,45.72 124.46,43.18 R28.2 123.19,35.56 115.57,35.56 114.3,34.29 114.3,30.48 118.11,26.67 118.11,20.32 S7.2 114.94,17.14 111.76,13.97 98.42,13.97 97.16,12.7 97.16,5.71 R25.2
N$34
  Bottom 0.813: SUBOCT.2 29.21,87.63 33.02,91.44 IC4.1
N$35
  Bottom 0.813: R27.2 119.38,52.07 123.19,48.26 C8.1
N$36  (via drill 0.35)
  Top 0.813: v135.89,56.52 v146.05,56.52
  Bottom 0.813: R31.1 110.49,74.93 | 110.49,74.93 R30.2 110.49,63.5 113.03,60.96 127,60.96 131.44,56.52 v135.89,56.52 | v146.05,56.52 146.05,53.98 | 146.05,53.98 145.41,53.98 143.51,52.07 | 143.51,52.07 IC2.8 | C10.2 143.51,52.07 | S5.3 107.95,24.77 107.95,40.64 109.22,41.91 114.3,41.91 116.84,39.37 120.65,39.37 123.19,41.91 123.19,45.72 120.65,48.26 109.86,48.26 105.41,52.7 105.41,66.04 102.87,68.58 95.25,68.58 93.98,69.85 93.98,72.39 96.52,74.93 110.49,74.93 | R32.1 158.75,57.15 156.21,53.98 146.05,53.98
N$37
  Bottom 0.813: R27.1 110.49,35.56 R28.1 111.76,27.94 S7.3
N$38
  Bottom 0.813: IC3.5 151.13,10.16 R23.1
N$39
  Bottom 0.813: C10.1 137.16,49.53 IC2.1
N$40
  Bottom 0.813: C12.1 R35.2
N$41
  Bottom 0.813: R36.1 127,22.86 128.27,24.13 R35.1 121.92,25.4 S7.6
N$42
  Bottom 0.813: C15.1 135.89,20.32 IC3.1
N$43
  Bottom 0.813: IC3.8 143.51,21.59 | 143.51,21.59 C15.2 | 143.51,21.59 R38.2 147.32,19.05 152.4,13.97 | 152.4,13.97 154.94,11.43 154.94,8.89 152.4,6.35 149.86,6.35 146.69,3.17 113.67,3.17 106.05,10.79 S5.1 | R40.1 170.18,17.78 166.37,13.97 152.4,13.97
N$44
  Bottom 0.813: IC3.3 129.54,12.7 | 129.54,12.7 125.73,12.7 | 125.73,12.7 127,11.43 R36.2 | 129.54,12.7 129.54,22.86 130.81,24.13 C13.1 124.46,31.75 R34.2 | R36.2 129.54,6.35 144.78,6.35 R38.1 | R33.2 119.38,5.08 120.65,6.35 124.46,6.35 R36.2 | 125.73,12.7 121.28,17.14 S7.5
N$45
  Bottom 0.813: R39.2 R31.2 114.94,94.61 164.47,94.61 167.64,91.44 C11.+
N$46
  Bottom 0.813: VOLUME.2 161.29,86.36 C11.-
N$47
  Bottom 0.813: R45.2 127,57.15 130.81,53.34 C20.1
N$48
  Bottom 0.813: C19.- 124.46,88.9 SPK_E.TP 122.56,70.15 131.74,60.96 135.89,60.96 IC5.7
N$49
  Bottom 0.813: R44.1 170.18,74.93 | 170.18,74.93 168.91,74.93 167.64,73.66 D4.C | Q5.B 170.18,74.93
N$50
  Bottom 0.813: R43.2 147.32,64.77 IC5.2
N$51
  Bottom 0.813: R43.1 154.81,52.2 C16.+
N$52
  Bottom 0.813: R41.2 OUT_G.TP
N$53
  Bottom 0.813: R41.1 R42.2 153.67,67.31 152.4,66.04 IC5.3
N$54
  Bottom 0.813: S6.2 161.29,17.78 | 161.29,17.78 S6.5 | POW_J.TP 161.29,17.78
PULSE
  Bottom 0.813: R70.2 D1.C 38.1,48.26 43.18,43.18 43.18,41.91 | D2.A 41.91,36.83 43.18,38.1 R3.2 43.18,41.91 | IC1.13 43.18,41.91
PWM  (via drill 0.6)
  Top 0.813: v74.93,35.56 v87.63,35.56
  Bottom 0.813: IC1.2 59.69,41.91 60.96,43.18 67.31,43.18 71.12,39.37 74.93,39.37 | 74.93,39.37 v74.93,35.56 | v87.63,35.56 92.71,40.64 99.06,40.64 104.14,35.56 R34.1 | 74.93,39.37 93.98,58.42 R26.1
SAW
  Bottom 0.813: 53.34,49.53 IC1.10 46.99,49.53 R2.2 | 53.34,49.53 IC1.5 | S1.3 21.59,11.43 C2.2 29.84,9.53 37.47,9.53 41.91,13.97 45.72,13.97 46.99,15.24 46.99,19.05 44.45,21.59 44.45,26.67 46.99,29.21 49.53,29.21 50.8,30.48 50.8,34.29 53.34,36.83 53.34,49.53
SUBOCTAVE
  Bottom 0.813: R33.1 100.97,1.91 85.09,1.91 | 85.09,1.91 66.67,1.91 63.5,5.08 60.96,5.08 59.05,3.17 17.14,3.17 9.53,10.79 9.53,40.01 10.16,40.64 12.7,40.64 13.97,39.37 19.05,39.37 27.94,48.26 SUBOCT.3 | R25.1 85.09,1.91
VCC  (via drill 0.6)
  Top 0.813: v62.23,2.54 v62.23,16.51 | v167.64,96.52 v167.64,83.82
  Bottom 0.813: 48.26,90.17 48.26,91.44 IC4.14 45.72,96.52 | 48.26,90.17 48.26,82.55 46.99,81.28 IC4.10 | IC3.7 142.24,15.24 140.97,16.51 140.97,24.13 143.51,26.67 R29.2 146.05,33.02 149.86,36.83 152.4,36.83 | IC2.7 148.59,45.72 R22.2 153.67,46.99 154.94,48.26 158.12,48.26 163.19,43.18 166.37,43.18 | R19.1 59.69,20.32 Q2.C 59.69,19.05 v62.23,16.51 63.5,15.24 R12.2 | 10.16,48.26 7.62,45.72 7.62,10.16 15.88,1.91 61.59,1.91 v62.23,2.54 | R7.2 R4.1 48.26,73.66 62.23,87.63 R9.2 62.23,96.52 | 152.4,36.83 Q4.C | R17.2 20.32,48.26 PCH_BEND.3 10.16,48.26 | 10.16,48.26 8.89,49.53 8.89,88.9 16.51,96.52 45.72,96.52 | 45.72,96.52 62.23,96.52 | 62.23,96.52 86.36,96.52 | 86.36,96.52 v167.64,96.52 | 86.36,96.52 START_FRQ.2 STOP_FRQ.2 | 48.26,90.17 51.31,90.17 C5.+ | v167.64,83.82 Q5.E 165.1,77.47 165.1,69.85 170.18,64.77 170.18,60.96 172.72,58.42 172.72,52.07 166.37,45.72 166.37,43.18 | 166.37,43.18 166.37,39.37 163.83,36.83 152.4,36.83

### Text on the board
tNames: EX 400 Mini Synth / Electro Harmonix